# Altium project MakerCard.PrjPcb
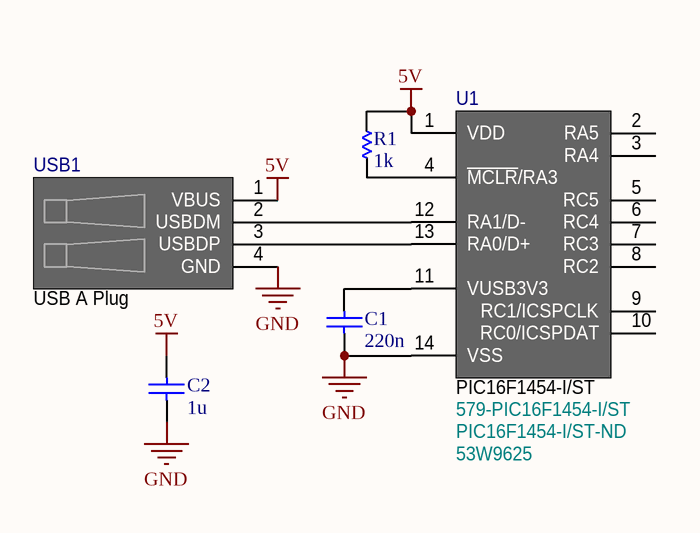
[diagram p0: MakerCard.SchDoc]
1 sheet, 5 parts. Net scope: global (net labels, ports and power ports of the same name join across sheets).
Board file: MakerCard.PcbDoc

## Sheet MakerCard.SchDoc
size A

### Parts
C1  220n  [CAPC1005N]
C2  1u  [CAPC1608N]
R1  1k  [RESC1005N]
U1  PIC16F1454-I/ST  Supplier Part Number 1: 579-PIC16F1454-I/ST  Supplier Part Number 2: PIC16F1454-I/ST-ND  Supplier Part Number 3: 53W9625  [TSOP65P640-14AN]
USB1  USB A Plug  [USB_A_EDGECONNECTOR]

### Nets
5V: C2.2 R1.2 U1.1(VDD) USB1.1(VBUS)
GND: C1.1 C2.1 U1.14(VSS) USB1.4(GND)
NetC1_2: C1.2 U1.11(VUSB3V3)
NetR1_1: R1.1 U1.4(~{MCLR}/RA3)
NetU1_12: U1.12(RA1/D-) USB1.2(USBDM)
NetU1_13: U1.13(RA0/D+) USB1.3(USBDP)

Not connected (* = marked no-connect by the designer): U1 2(RA5) 3(RA4) 5(RC5) 6(RC4) 7(RC3) 8(RC2) 9(RC1/ICSPCLK) 10(RC0/ICSPDAT)

### Library data of the parts
C1 C2 = Cap Semi: Capacitor (Semiconductor SIM Model); Published: 8-Jun-2000; LatestRevisionDate: 29-May-2009; LatestRevisionNote: IPC-7351 Footprint Added.; PackageReference: C1206; Publisher: Altium Limited; PackageDescription: Chip Capacitor
R1 = Res Semi: Semiconductor Resistor; Published: 8-Jun-2000; LatestRevisionDate: 17-Jul-2002; LatestRevisionNote: Re-released for DXP Platform.; PackageReference: AXIAL-0.5; Publisher: Altium Limited; PackageDescription: Axial Device, Thru-Hole; 2 Leads; 0.5 in Pin Spacing
U1 = PIC16F1454-I/ST: 8-bit Microcontrollers - MCU 7 KB Flash 512 bytes RAM 48 MHz Int Osc; Manufacturer: Microchip Technology; Data RAM Size: 1024 B; Interface Type: USB; Number of I/Os: 11 I/O; Program Memory Size: 14 kB; Core: PIC; Data Bus Width: 8 bit; Maximum Clock Frequency: 48 MHz; Number of Timers: 3 Timer; On-Chip ADC: Yes; Operating Supply Voltage: 2.3 V to 5.5 V; Processor Series: PIC16; Product Status: New Product; Supplier 1: Mouser; Manufacturer Part Number: PIC16F1454-I/ST; RoHS: RoHS Compliant; Category: 8-bit Microcontrollers - MCU; Stock 1: 353; Pricing 1: 1=1.57, 10=1.31, 25=1.20, 100=1.09 (USD); Package / Case: TSSOP-14; Packaging: Tube; Program Memory Type: Flash; Brand: Microchip Technology; Data RAM Type: RAM; Mounting Style: SMD/SMT; Maximum Operating Temperature: + 85 C; Minimum Operating Temperature: - 40 C; Standard Pack Qty: 96; RoHS - Mouser: Y; Minimum Order Quantity: 1; Reeling: False; ComponentLink1URL: http://www.mouser.com/ds/2/268/41639A-218089.pdf; ComponentLink1Description: http://www.mouser.com/ds/2/268/41639A-218089.pdf; Supplier 2: Digi-Key; Supplier 3: Newark